# Altium schematic sheet MB_audio_esp.SchDoc: Материнская плата
size 420 x 297 mm; DrawnBy: В.Титов; DocumentNumber: ХХХХ.468179.001 Э3; SheetNumber: 7; SheetTotal: 7; DocumentType: Схема электрическая принципиальная; Title2: Питание процессора
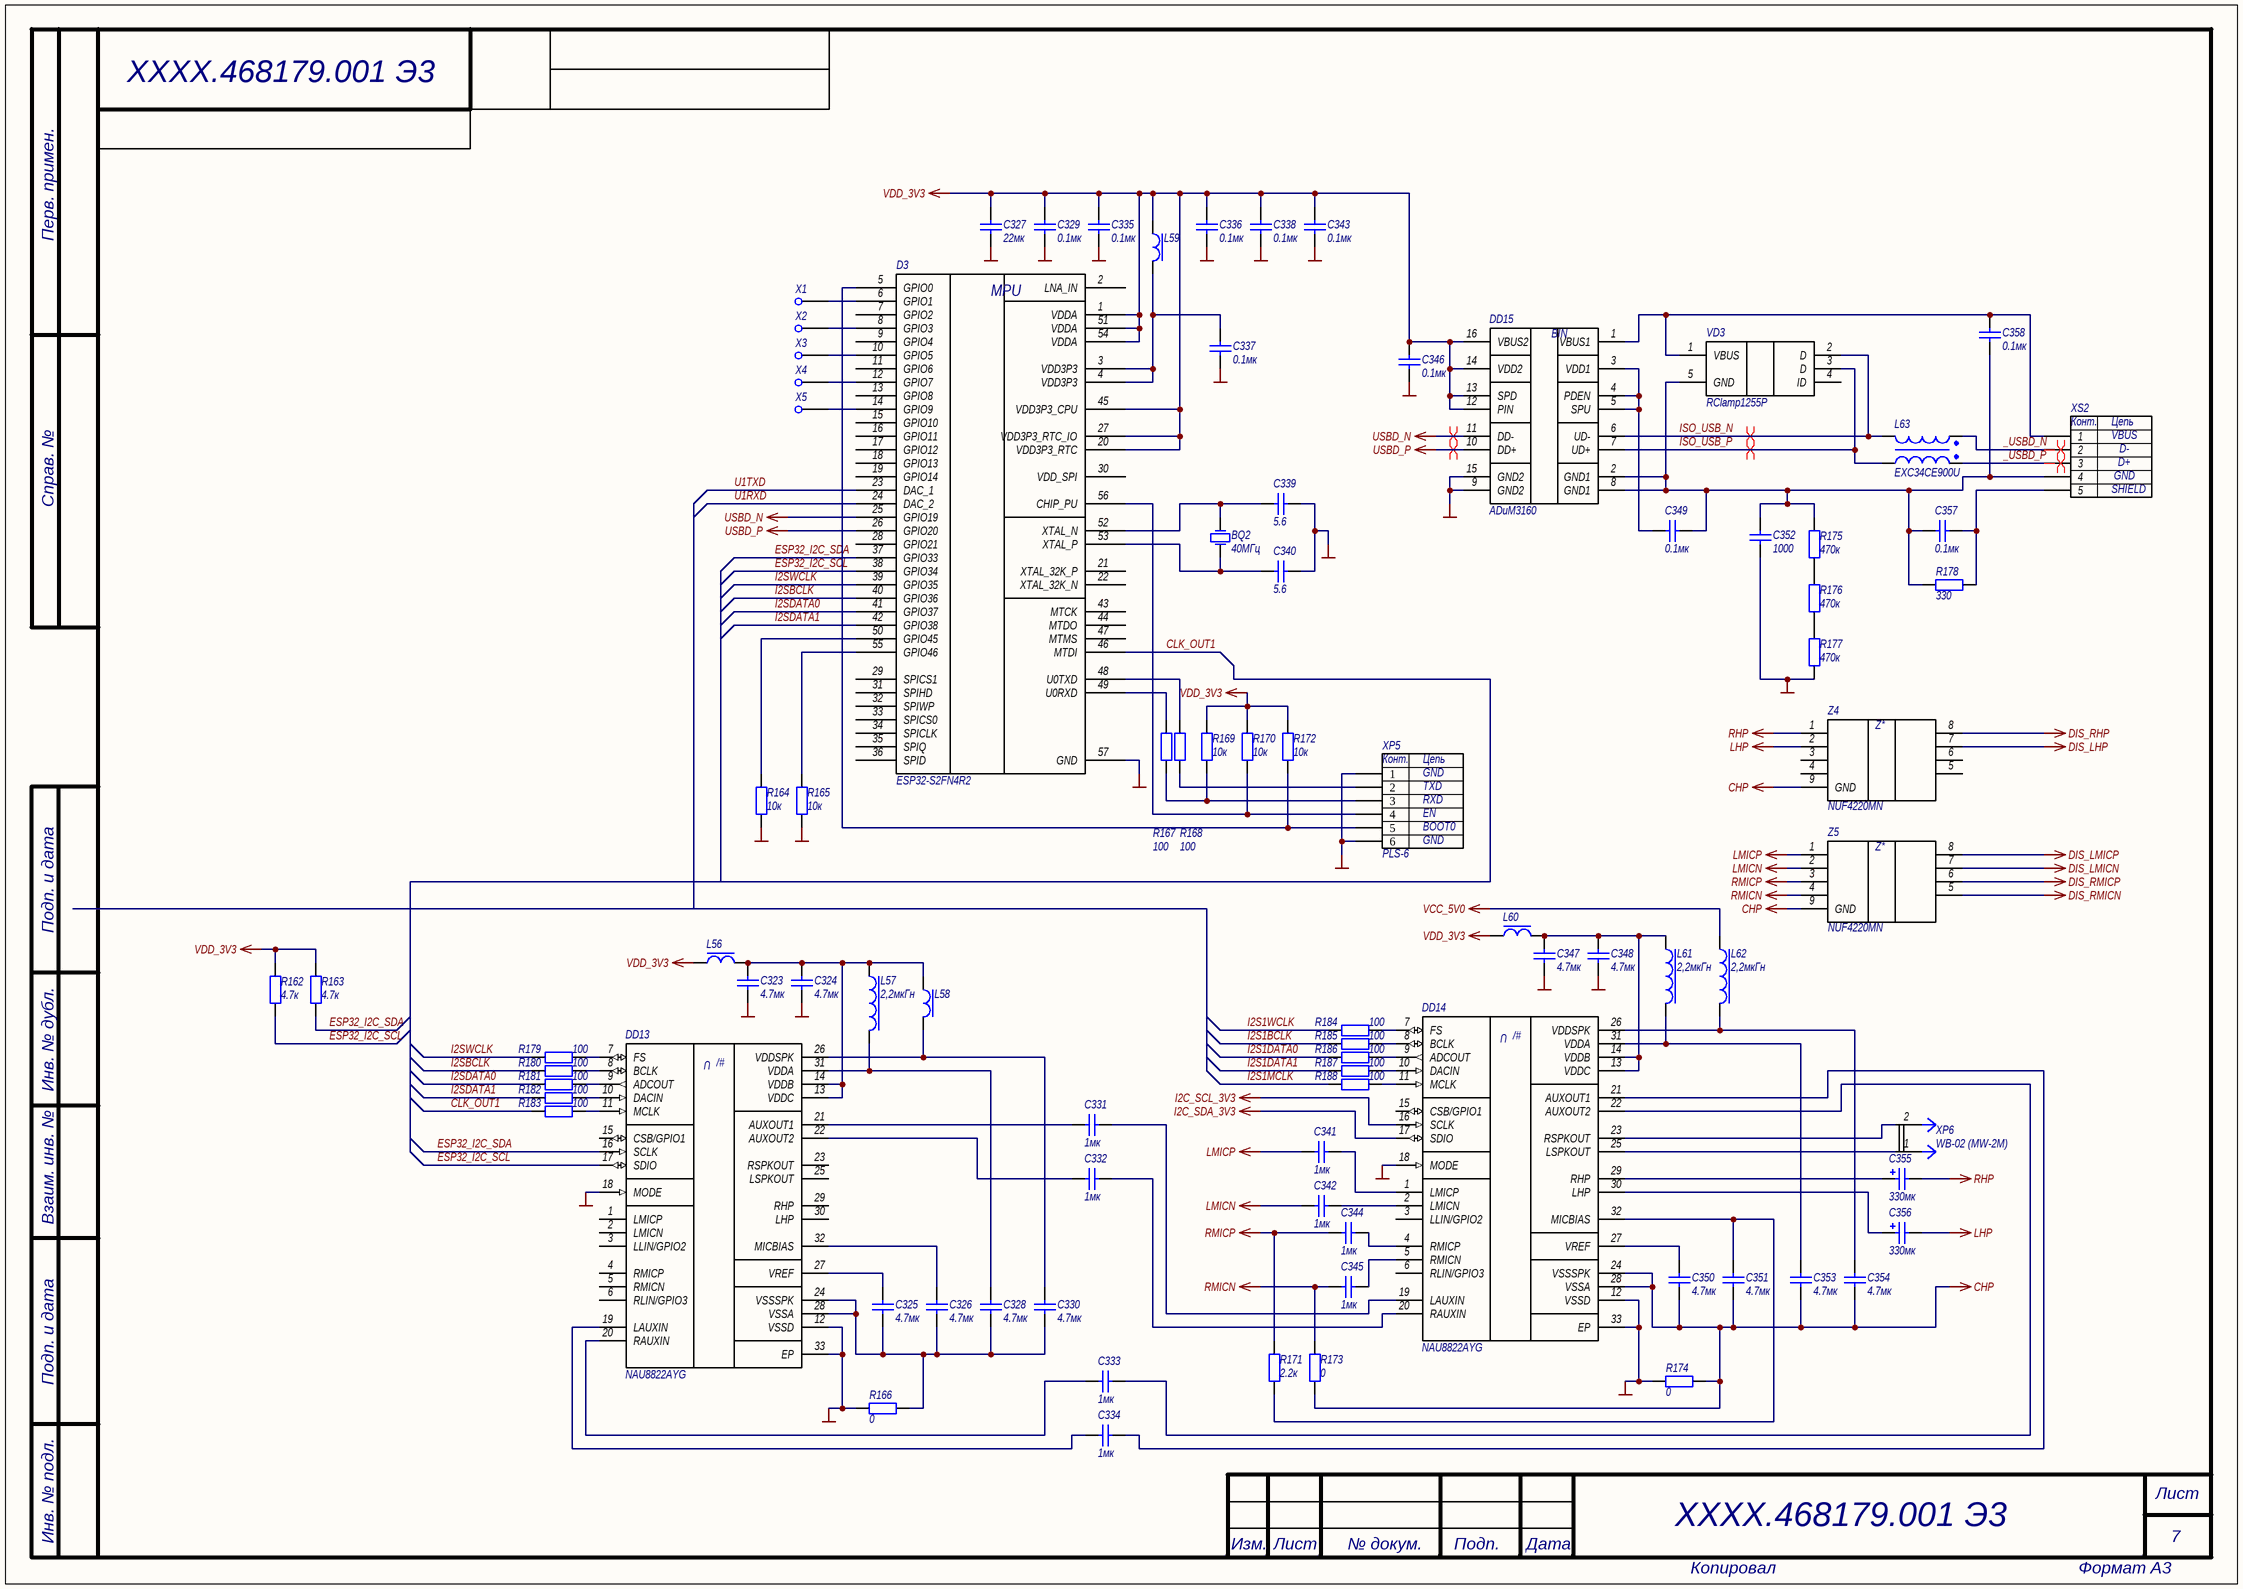
[diagram p0: MB_audio_esp.SchDoc]

## Parts
BQ2  40МГц  [ABRACOM ABM10]
C323  4.7мк  [CAPC2012X12L]
C324  4.7мк  [CAPC2012X12L]
C325  4.7мк  [CAPC2012X12L]
C326  4.7мк  [CAPC2012X12L]
C327  22мк  [CAPC2012X12L]
C328  4.7мк  [CAPC2012X12L]
C329  0.1мк  [CAPC1005X06N]
C330  4.7мк  [CAPC2012X12L]
C331  1мк  [CAPC1005X06N]
C332  1мк  [CAPC1005X06N]
C333  1мк  [CAPC1005X06N]
C334  1мк  [CAPC1005X06N]
C335  0.1мк  [CAPC1005X06N]
C336  0.1мк  [CAPC1005X06N]
C337  0.1мк  [CAPC1005X06N]
C338  0.1мк  [CAPC1005X06N]
C339  5.6  [CAPC1005X06N]
C340  5.6  [CAPC1005X06N]
C341  1мк  [CAPC1005X06N]
C342  1мк  [CAPC1005X06N]
C343  0.1мк  [CAPC1005X06N]
C344  1мк  [CAPC1005X06N]
C345  1мк  [CAPC1005X06N]
C346  0.1мк  [CAPC1005X06N]
C347  4.7мк  [CAPC2012X12L]
C348  4.7мк  [CAPC2012X12L]
C349  0.1мк  [CAPC1608X08L]
C350  4.7мк  [CAPC2012X12L]
C351  4.7мк  [CAPC2012X12L]
C352  1000  [CAPRD7.5-9x5]
C353  4.7мк  [CAPC2012X12L]
C354  4.7мк  [CAPC2012X12L]
C355  330мк  [CAPAE116103X105N]
C356  330мк  [CAPAE116103X105N]
C357  0.1мк  [CAPC1608X08L]
C358  0.1мк  [CAPC1608X08L]
D3  ESP32-S2FN4R2  [QFN40P700X700X80-56N]
DD13  NAU8822AYG  [QFN50P500X500X100_HS-33L]
DD14  NAU8822AYG  [QFN50P500X500X100_HS-33L]
DD15  ADuM3160  [SOIC127P1030X265-16N]
L56  BLM18PG121SN1D  [INDC1608X08L]  (value not drawn)
L57  2,2мкГн  [CSAB0420]
L58  BLM18PG121SN1D  [INDC1608X08L]  (value not drawn)
L59  BLM18PG121SN1D  [INDC1608X08L]  (value not drawn)
L60  BLM18PG121SN1D  [INDC1608X08L]  (value not drawn)
L61  2,2мкГн  [CSAB0420]
L62  2,2мкГн  [CSAB0420]
L63  EXC34CE900U  [EXC34CE900U]
R162  4.7к  [RESC1005X06N]
R163  4.7к  [RESC1005X06N]
R164  10к  [RESC1005X06N]
R165  10к  [RESC1005X06N]
R166  0  [RESC1005X06N]
R167  100  [RESC1005X06N]
R168  100  [RESC1005X06N]
R169  10к  [RESC1005X06N]
R170  10к  [RESC1005X06N]
R171  2.2к  [RESC1005X06N]
R172  10к  [RESC1005X06N]
R173  0  [RESC1005X06N]
R174  0  [RESC1005X06N]
R175  470к  [RESC1005X06N]
R176  470к  [RESC1005X06N]
R177  470к  [RESC1005X06N]
R178  330  [RESC1005X06N]
R179  100  [RESC1005X06N]
R180  100  [RESC1005X06N]
R181  100  [RESC1005X06N]
R182  100  [RESC1005X06N]
R183  100  [RESC1005X06N]
R184  100  [RESC1005X06N]
R185  100  [RESC1005X06N]
R186  100  [RESC1005X06N]
R187  100  [RESC1005X06N]
R188  100  [RESC1005X06N]
VD3  RClamp1255P  [SLP2018P6]
X1  Конструктивный элемент  [PIN2_PROBE]  (value not drawn)  (no BOM)
X2  Конструктивный элемент  [PIN2_PROBE]  (value not drawn)  (no BOM)
X3  Конструктивный элемент  [PIN2_PROBE]  (value not drawn)  (no BOM)
X4  Конструктивный элемент  [PIN2_PROBE]  (value not drawn)  (no BOM)
X5  Конструктивный элемент  [PIN2_PROBE]  (value not drawn)  (no BOM)
XP5  PLS-6  [HDR1X6]
XP6  WB-02 (MW-2M)  [WB-02 (MW-2M) pitch 2.00mm]
XS2  USBB-1J  [USB2.5-2H4D]  (value not drawn)
Z4  NUF4220MN  [QFN50P200X200X80_HS-9L]
Z5  NUF4220MN  [QFN50P200X200X80_HS-9L]

## Nets
CHP: C350.2 C351.2 C353.2 C354.2 DD14.24(VSSSPK) DD14.28(VSSA) R173.1 R174.2 Z4.9(GND) Z5.9(GND)
DIS_LHP: Z4.7
DIS_LMICN: Z5.7
DIS_LMICP: Z5.8
DIS_RHP: Z4.8
DIS_RMICN: Z5.5
DIS_RMICP: Z5.6
GND: C323.2 C324.2 C327.1 C329.1 C335.1 C336.1 C337.1 C338.1 C339.1 C340.1 C343.1 C346.1 C347.2 C348.2 C352.2 D3.57(GND) DD13.12(VSSD) DD13.18(MODE) DD13.33(EP) DD14.12(VSSD) DD14.18(MODE) DD14.33(EP) DD15.9(GND2) DD15.15(GND2) R164.2 R165.2 R166.1 R174.1 R177.1 XP5.1 XP5.6
I2C_SCL_3V3: DD14.16(SCLK)
I2C_SDA_3V3: DD14.17(SDIO)
LHP: C356.2 Z4.2
LMICN: C342.1 Z5.2
LMICP: C341.1 Z5.1
RHP: C355.2 Z4.1
RMICN: C345.1 R173.2 Z5.4
RMICP: C344.1 R171.2 Z5.3
USBD_N: D3.25(GPIO19) DD15.11(DD-)
USBD_P: D3.26(GPIO20) DD15.10(DD+)
VCC_5V0: L62.1
VDD_3V3: C327.2 C329.2 C335.2 C336.2 C338.2 C343.2 C346.2 D3.1(VDDA) D3.20(VDD3P3_RTC) D3.27(VDD3P3_RTC_IO) D3.45(VDD3P3_CPU) D3.51(VDDA) D3.54(VDDA) DD15.12(PIN) DD15.13(SPD) DD15.14(VDD2) DD15.16(VBUS2) L56.1 L59.1 L60.1 R162.1 R163.1 R169.1 R170.1 R172.1
_USBD_N: L63.1 XS2.2
_USBD_P: L63.4 XS2.3
CLK_OUT1: D3.46(MTDI) R183.1
ESP32_I2C_SCL: D3.38(GPIO34) DD13.17(SDIO) R162.2
ESP32_I2C_SDA: D3.37(GPIO33) DD13.16(SCLK) R163.2
I2S1BCLK: R185.1
I2S1DATA0: R186.1
I2S1DATA1: R187.1
I2S1MCLK: R188.1
I2S1WCLK: R184.1
I2SBCLK: D3.40(GPIO36) R180.1
I2SDATA0: D3.41(GPIO37) R181.1
I2SDATA1: D3.42(GPIO38) R182.1
I2SWCLK: D3.39(GPIO35) R179.1
ISO_USB_N: DD15.6(UD-) L63.2 VD3.2(D)
ISO_USB_P: DD15.7(UD+) L63.3 VD3.3(D)
U1RXD: D3.24(DAC_2)
U1TXD: D3.23(DAC_1)
NetBQ2_1: BQ2.1(OSC1) C340.2 D3.53(XTAL_P)
NetBQ2_3: BQ2.3(OSC2) C339.2 D3.52(XTAL_N)
NetC323_1: C323.1 C324.1 DD13.13(VDDC) DD13.14(VDDB) L56.2 L57.1 L58.1
NetC325_1: C325.1 DD13.27(VREF)
NetC325_2: C325.2 C326.2 C328.2 C330.2 DD13.24(VSSSPK) DD13.28(VSSA) R166.2
NetC326_1: C326.1 DD13.32(MICBIAS)
NetC328_1: C328.1 DD13.31(VDDA) L57.2
NetC330_1: C330.1 DD13.26(VDDSPK) L58.2
NetC331_1: C331.1 DD13.21(AUXOUT1)
NetC331_2: C331.2 DD14.19(LAUXIN)
NetC332_1: C332.1 DD13.22(AUXOUT2)
NetC332_2: C332.2 DD14.20(RAUXIN)
NetC333_1: C333.1 DD13.20(RAUXIN)
NetC333_2: C333.2 DD14.22(AUXOUT2)
NetC334_1: C334.1 DD13.19(LAUXIN)
NetC334_2: C334.2 DD14.21(AUXOUT1)
NetC337_2: C337.2 D3.3(VDD3P3) D3.4(VDD3P3) L59.2
NetC341_2: C341.2 DD14.1(LMICP)
NetC342_2: C342.2 DD14.2(LMICN)
NetC344_2: C344.2 DD14.4(RMICP)
NetC345_2: C345.2 DD14.5(RMICN)
NetC347_1: C347.1 C348.1 DD14.13(VDDC) DD14.14(VDDB) L60.2 L61.1
NetC349_1: C349.1 C352.1 C357.2 C358.1 DD15.2(GND1) DD15.8(GND1) R175.2 R178.2 VD3.5(GND) XS2.4
NetC349_2: C349.2 DD15.3(VDD1) DD15.4(PDEN) DD15.5(SPU)
NetC350_1: C350.1 DD14.27(VREF)
NetC351_1: C351.1 DD14.32(MICBIAS) R171.1
NetC353_1: C353.1 DD14.31(VDDA) L61.2
NetC354_1: C354.1 DD14.26(VDDSPK) L62.2
NetC355_1: C355.1 DD14.29(RHP)
NetC356_1: C356.1 DD14.30(LHP)
NetC357_1: C357.1 R178.1 XS2.5
NetC358_2: C358.2 DD15.1(VBUS1) VD3.1(VBUS) XS2.1
NetD3_5: D3.5(GPIO0) R172.2 XP5.5
NetD3_6: D3.6(GPIO1) X1.1
NetD3_8: D3.8(GPIO3) X2.1
NetD3_10: D3.10(GPIO5) X3.1
NetD3_12: D3.12(GPIO7) X4.1
NetD3_14: D3.14(GPIO9) X5.1
NetD3_48: D3.48(U0TXD) R168.2
NetD3_49: D3.49(U0RXD) R167.1
NetD3_50: D3.50(GPIO45) R164.1
NetD3_55: D3.55(GPIO46) R165.1
NetD3_56: D3.56(CHIP_PU) R170.2 XP5.4
NetDD13_7: DD13.7(FS) R179.2
NetDD13_8: DD13.8(BCLK) R180.2
NetDD13_9: DD13.9(ADCOUT) R181.2
NetDD13_10: DD13.10(DACIN) R182.2
NetDD13_11: DD13.11(MCLK) R183.2
NetDD14_7: DD14.7(FS) R184.2
NetDD14_8: DD14.8(BCLK) R185.2
NetDD14_9: DD14.9(ADCOUT) R186.2
NetDD14_10: DD14.10(DACIN) R187.2
NetDD14_11: DD14.11(MCLK) R188.2
NetDD14_23: DD14.23(RSPKOUT) XP6.2
NetDD14_25: DD14.25(LSPKOUT) XP6.1
NetR167_2: R167.2 R169.2 XP5.3
NetR168_1: R168.1 XP5.2
NetR175_1: R175.1 R176.2
NetR176_1: R176.1 R177.2

Not connected (* = marked no-connect by the designer): D3 2(LNA_IN) 7(GPIO2) 9(GPIO4) 11(GPIO6) 13(GPIO8) 15(GPIO10) 16(GPIO11) 17(GPIO12) 18(GPIO13) 19(GPIO14) 21(XTAL_32K_P) 22(XTAL_32K_N) 28(GPIO21) 29(SPICS1) 30(VDD_SPI) 31(SPIHD) 32(SPIWP) 33(SPICS0) 34(SPICLK) 35(SPIQ) 36(SPID) 43(MTCK) 44(MTDO) 47(MTMS); DD13 1(LMICP) 2(LMICN) 3(LLIN/GPIO2) 4(RMICP) 5(RMICN) 6(RLIN/GPIO3) 15(CSB/GPIO1) 23(RSPKOUT) 25(LSPKOUT) 29(RHP) 30(LHP); DD14 3(LLIN/GPIO2) 6(RLIN/GPIO3) 15(CSB/GPIO1); VD3 4(ID); Z4 3 4 5 6

## Layout directives
differential pair: _USBD_N, _USBD_P, ISO_USB_N, ISO_USB_P, USBD_N, USBD_P

## Notes on the sheet
- (near XP5) GND
- (near XP5) TXD
- (near XP5) RXD
- (near XP5) EN
- (near XP5) BOOT0
- Перв. примен.
- Справ. №
- Подп. и дата
- Инв. № дубл.
- Взаим. инв. №
- Инв. № подл.
- Лист
- Изм.
- № докум.
- Подп.
- Дата
- Копировал
- Формат А3
- (in symbol Микросхема ADuM3160) BIN
- (in symbol Микросхема ESP32-S2FN4R2) MPU
- (in symbol Микросхема NAU8822AYG) U; /#
- (in symbol Соединитель PLS-6) Конт.; Цепь
- (in symbol Соединитель USBB-1J) Конт.; Цепь; VBUS; D-; D+; GND; SHIELD
- (in symbol Фильтр EMI NUF4220MN) Z*

## Library data of the parts
BQ2 = Кварц ABM10AIG-40.000MHZ: Резонатор кварцевый; Manufacturer: ABRACON; Tolerance: ±50 ppm; Value: 40МГц
C323-C326 C328 C330 C347 C348 C350 C351 C353 C354 = Кер.ЧИП конд. 0805 4,7мкФ X5R 20% 16В: Кер. ЧИП-конденсатор; Manufacturer: Murata; ManufacturerPartNumber: GRM21BR61A476ME15L; Power/Voltage: 16В; TKE: X5R; Tolerance: ±20%; Value: 4.7мк
C327 = Кер.ЧИП конд. 0805 22мкФ X5R 10% 16В: Кер. ЧИП-конденсатор; Manufacturer: TDK; ManufacturerPartNumber: C2012X5R1C226KT; Power/Voltage: 16В; TKE: X5R; Tolerance: ±10%; Value: 22мк
C329 C335-C338 C343 C346 = Кер.ЧИП конд. 0402 0.1мкФ X7R 10%, 16В: Кер. ЧИП-конденсатор; Power/Voltage: 16В; TKE: X7R; Tolerance: ±10%; PackageReference: 0402; Value: 0.1мк
C331-C334 C341 C342 C344 C345 = Кер.ЧИП конд. 0402 1мкФ X5R 10%, 10В: Кер. ЧИП-конденсатор; Power/Voltage: 10В; TKE: X5R; Tolerance: ±10%; Value: 1мк; PackageReference: 0402
C339 C340 = Кер.ЧИП конд. 0402 5.6пФ C0G, 50В: Кер. ЧИП-конденсатор; Power/Voltage: 50В; TKE: C0G; Tolerance: ±5%; Value: 5.6
C349 C357 C358 = Кер.ЧИП конд. 0603 0.1мкФ X7R 10% 50В: Кер. ЧИП-конденсатор; Manufacturer: Murata; ManufacturerPartNumber: GRM188R71H104KA93D; Power/Voltage: 50В; TKE: X7R; Tolerance: ±10%; Value: 0.1мк
C352 = Конденсатор керамический защищенный 1000pF 250V AC (DE1E3KX102MA4BN01F): Защищенные конденсаторы 1000pF 250Vrms 20% L/S=10mm Bulk long; Manufacturer: MURATA; Power/Voltage: 250VAC; TKE: X1Y1; Tolerance: ±10%; Published: 8-Jun-2000; LatestRevisionDate: 17-Jul-2002; LatestRevisionNote: Re-released for DXP Platform.; Publisher: Altium Limited; PackageReference: Type KX Small Size; ManufacturerPartNumber: DE1E3KX102MA4BN01F; Value: 1000
C355 C356 = Конденсатор гибридный SMD 330мкФ ±20% 35В: Гибридный ЧИП-конденсатор; Manufacturer: Panasonic; ManufacturerPartNumber: EEHZK1V331P; Power/Voltage: 35В; Tolerance: ±20%; Value: 330мк; Published: 8-Jun-2000; LatestRevisionDate: 29-May-2009; LatestRevisionNote: IPC-7351 Footprint Added.; Publisher: Altium Limited; PackageDescription: ZK series; PackageReference: ZK series
D3 = Микросхема ESP32-S2FN4R2: SoC with Xtensa® Single-Core 32-bit LX7 Microprocessor; Manufacturer: STMicroelectronics; Published: 29-Jan-2009; DatasheetVersion: revB, Mar-2008; PackageVersion: revAW, Oct-2008; PackageReference: UFQFPN48; Publisher: Altium Limited; Code_JEDEC: MS-026; ComponentLink1Description: Manufacturer Link; ComponentLink3Description: Packaging Specification; Value: ESP32-S2FN4R2
DD13 DD14 = Микросхема NAU8822AYG: 24-bit Stereo Audio Codec with Speaker Driver; Manufacturer: NUVOTON; Value: NAU8822AYG
DD15 = Микросхема ADuM3160: Full/Low Speed 2.5 kV USB Digital Isolator /; Manufacturer: AD; Value: ADuM3160; ComponentLink1Description: datasheet; ComponentLink1URL: https://www.analog.com/media/en/technical-documentation/data-sheets/ADuM5210_5211_5212.pdf
L56 L58-L60 = ЧИП дроссель 0603 BLM18PG121SN1D: SMD EMI Suppression Filter EMIFIL; Manufacturer: Murata; ManufacturerPartNumber: BLM18PG121SN1D; Value: BLM18PG121SN1D
L57 L61 L62 = ЧИП индуктивность CSAB0420-2R2M: Molding Power Choke; Manufacturer: Vishay; ManufacturerPartNumber: IHLP1616ABER1R0M11; Value: 2,2мкГн
L63 = ЧИП синфазный фильтр 0805 EXC34CE900U: Common Mode Noise Filters EXC34CG/CE type; Manufacturer: Panasonic; ManufacturerPartNumber: EXC34CE900U; Value: EXC34CE900U; ComponentLink1Description: datasheet; ComponentLink1URL: https://industrial.panasonic.com/cdbs/www-data/pdf/AWE0000/AWE0000C276.pdf
R162 R163 = Чип резистор 0402 4,7 кОм, 5%: ЧИП-резистор; Tolerance: ±5%; TKE: 100 ppm/°С; PackageReference: 0402; Value: 4.7к
R164 R165 R169 R170 R172 = Чип резистор 0402 10 кОм, 5%: ЧИП-резистор; Tolerance: ±5%; TKE: 100 ppm/°С; PackageReference: 0402; Value: 10к
R166 R173 R174 = Чип резистор 0402 0 Ом: ЧИП-резистор; Tolerance: ±5%; TKE: 100 ppm/°С; PackageReference: 0402; Value: 0
R167 R168 R179-R188 = Чип резистор 0402 100 Ом, 5%: ЧИП-резистор; Tolerance: ±5%; TKE: 100 ppm/°С; PackageReference: 0402; Value: 100
R171 = Чип резистор 0402 2,2 кОм, 5%: ЧИП-резистор; Tolerance: ±5%; TKE: 100 ppm/°С; PackageReference: 0402; Value: 2.2к
R175-R177 = Чип резистор 0402 470 кОм, 5%: ЧИП-резистор; Tolerance: ±5%; TKE: 100 ppm/°С; PackageReference: 0402; Value: 470к
R178 = Чип резистор 0402 330 Ом, 5%: ЧИП-резистор; Tolerance: ±5%; TKE: 100 ppm/°С; PackageReference: 0402; Value: 330
VD3 = Диодная сборка RClamp1255P: Low Capacitance RClamp Surge Protection for uUSB Interfaces; Manufacturer: SEMTECH; PackageReference: SLP1510N6; Value: RClamp1255P
X1-X5 = Соединение под пайку: Соединитель; Value: Конструктивный элемент
XP5 = Соединитель PLS-6: Вилка штыревая 2.54мм 1x6 прямая тип1; LatestRevisionDate: 17-Jul-2002; LatestRevisionNote: Re-released for DXP Platform.; Publisher: Altium Limited; Value: PLS-6
XP6 = Соединитель WB-02 (MW-2M): Соединитель; Value: WB-02 (MW-2M)
XS2 = Соединитель USBB-1J: Universal Serial Bus (USB) Shielded I/O Receptacle, Right Angle, Type B; Manufacturer: Connfly; Value: USBB-1J
Z4 Z5 = Фильтр EMI NUF4220MN: ESD/EMI Protection  for Audio Interfaces; Manufacturer: onsemi; PackageReference: DFN8; Value: NUF4220MN